# Altium schematic sheet LCD_Model.SchDoc
size A4
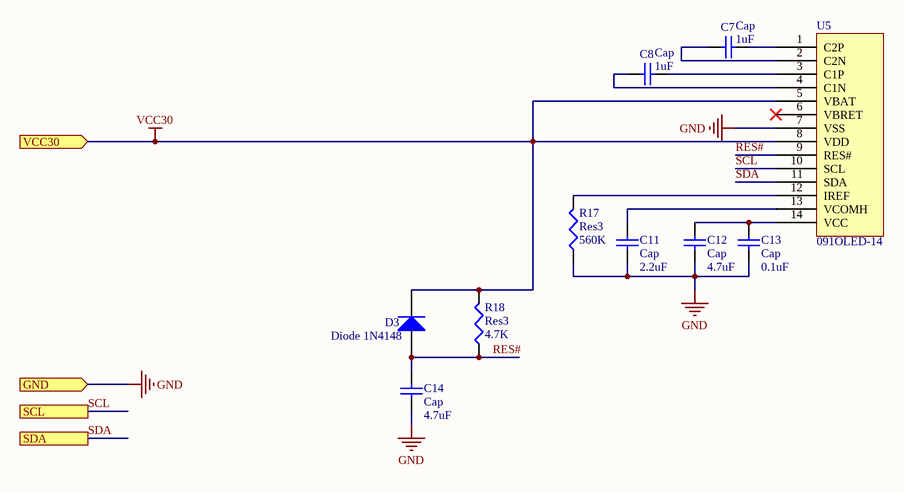
[diagram p0: LCD_Model.SchDoc]

## Parts
C7  Cap  value 1uF  [cap-0805]
C8  Cap  value 1uF  [cap-0805]
C11  Cap  value 2.2uF  [cap-0805]
C12  Cap  value 4.7uF  [cap-0805]
C13  Cap  value 0.1uF  [cap-0805]
C14  Cap  value 4.7uF  [cap-0805]
D3  Diode 1N4148  [PQX-DIO-0805]
R17  Res3  value 560K  [RES-1206]
R18  Res3  value 4.7K  [RES-1206]
U5  091OLED-14  [091OLED-FFC/FPC-0.64]

## Ports
GND (in), SCL, SDA, VCC30 (in)

## Nets
GND: C11.2 C12.1 C13.1 C14.1 R17.1 U5.7(VSS) ; port GND
VCC30: D3.2(K) R18.2 U5.5(VBAT) U5.8(VDD) ; port VCC30
RES#: C14.2 D3.1(A) R18.1 U5.9(RES#)
SCL: U5.10(SCL) ; port SCL
SDA: U5.11(SDA) ; port SDA
NetC7_1: C7.1 U5.2(C2N)
NetC7_2: C7.2 U5.1(C2P)
NetC8_1: C8.1 U5.4(C1N)
NetC8_2: C8.2 U5.3(C1P)
NetC11_1: C11.1 U5.13(VCOMH)
NetC12_2: C12.2 C13.2 U5.14(VCC)
NetR17_2: R17.2 U5.12(IREF)

Not connected (* = marked no-connect by the designer): U5 6(VBRET)*

## Library data of the parts
C7 C8 C11-C14 = Cap: Capacitor; Published: 8-Jun-2000; LatestRevisionDate: 17-Jul-2002; LatestRevisionNote: Re-released for DXP Platform.; PackageReference: RAD-0.3; Publisher: Altium Limited; PackageDescription: Radial Cap, Thru-Hole; 2 Leads; 0.3 in Pin Spacing
D3 = Diode 1N4148: High Conductance Fast Diode; Published: 8-Jun-2000; LatestRevisionDate: 17-Jul-2002; LatestRevisionNote: Re-released for DXP Platform.; DatasheetVersion: 1997; PackageReference: DO-35; Publisher: Altium Limited; PackageDescription: Diode, Axial; Body 3.8 x 1.9 mm (LxDia. max), Lead Dia. 0.53 mm (max); Code_JEDEC: DO-204-AH; ComponentLink1Description: Manufacturer Link; ComponentLink1URL: http://www.fairchildsemi.com/; ComponentLink2Description: Datasheet; ComponentLink2URL: http://www.fairchildsemi.com/ds/1N%2F1N4148.pdf
R17 R18 = Res3: Resistor; Published: 8-Jun-2000; LatestRevisionDate: 29-May-2009; LatestRevisionNote: IPC-7351 Footprint Added.; PackageReference: J1-0603; Publisher: Altium Limited; PackageDescription: Chip Resistor
U5 = 091oled-14pin